# EAGLE design TSAL_v1 (EAGLE 6.5.0)
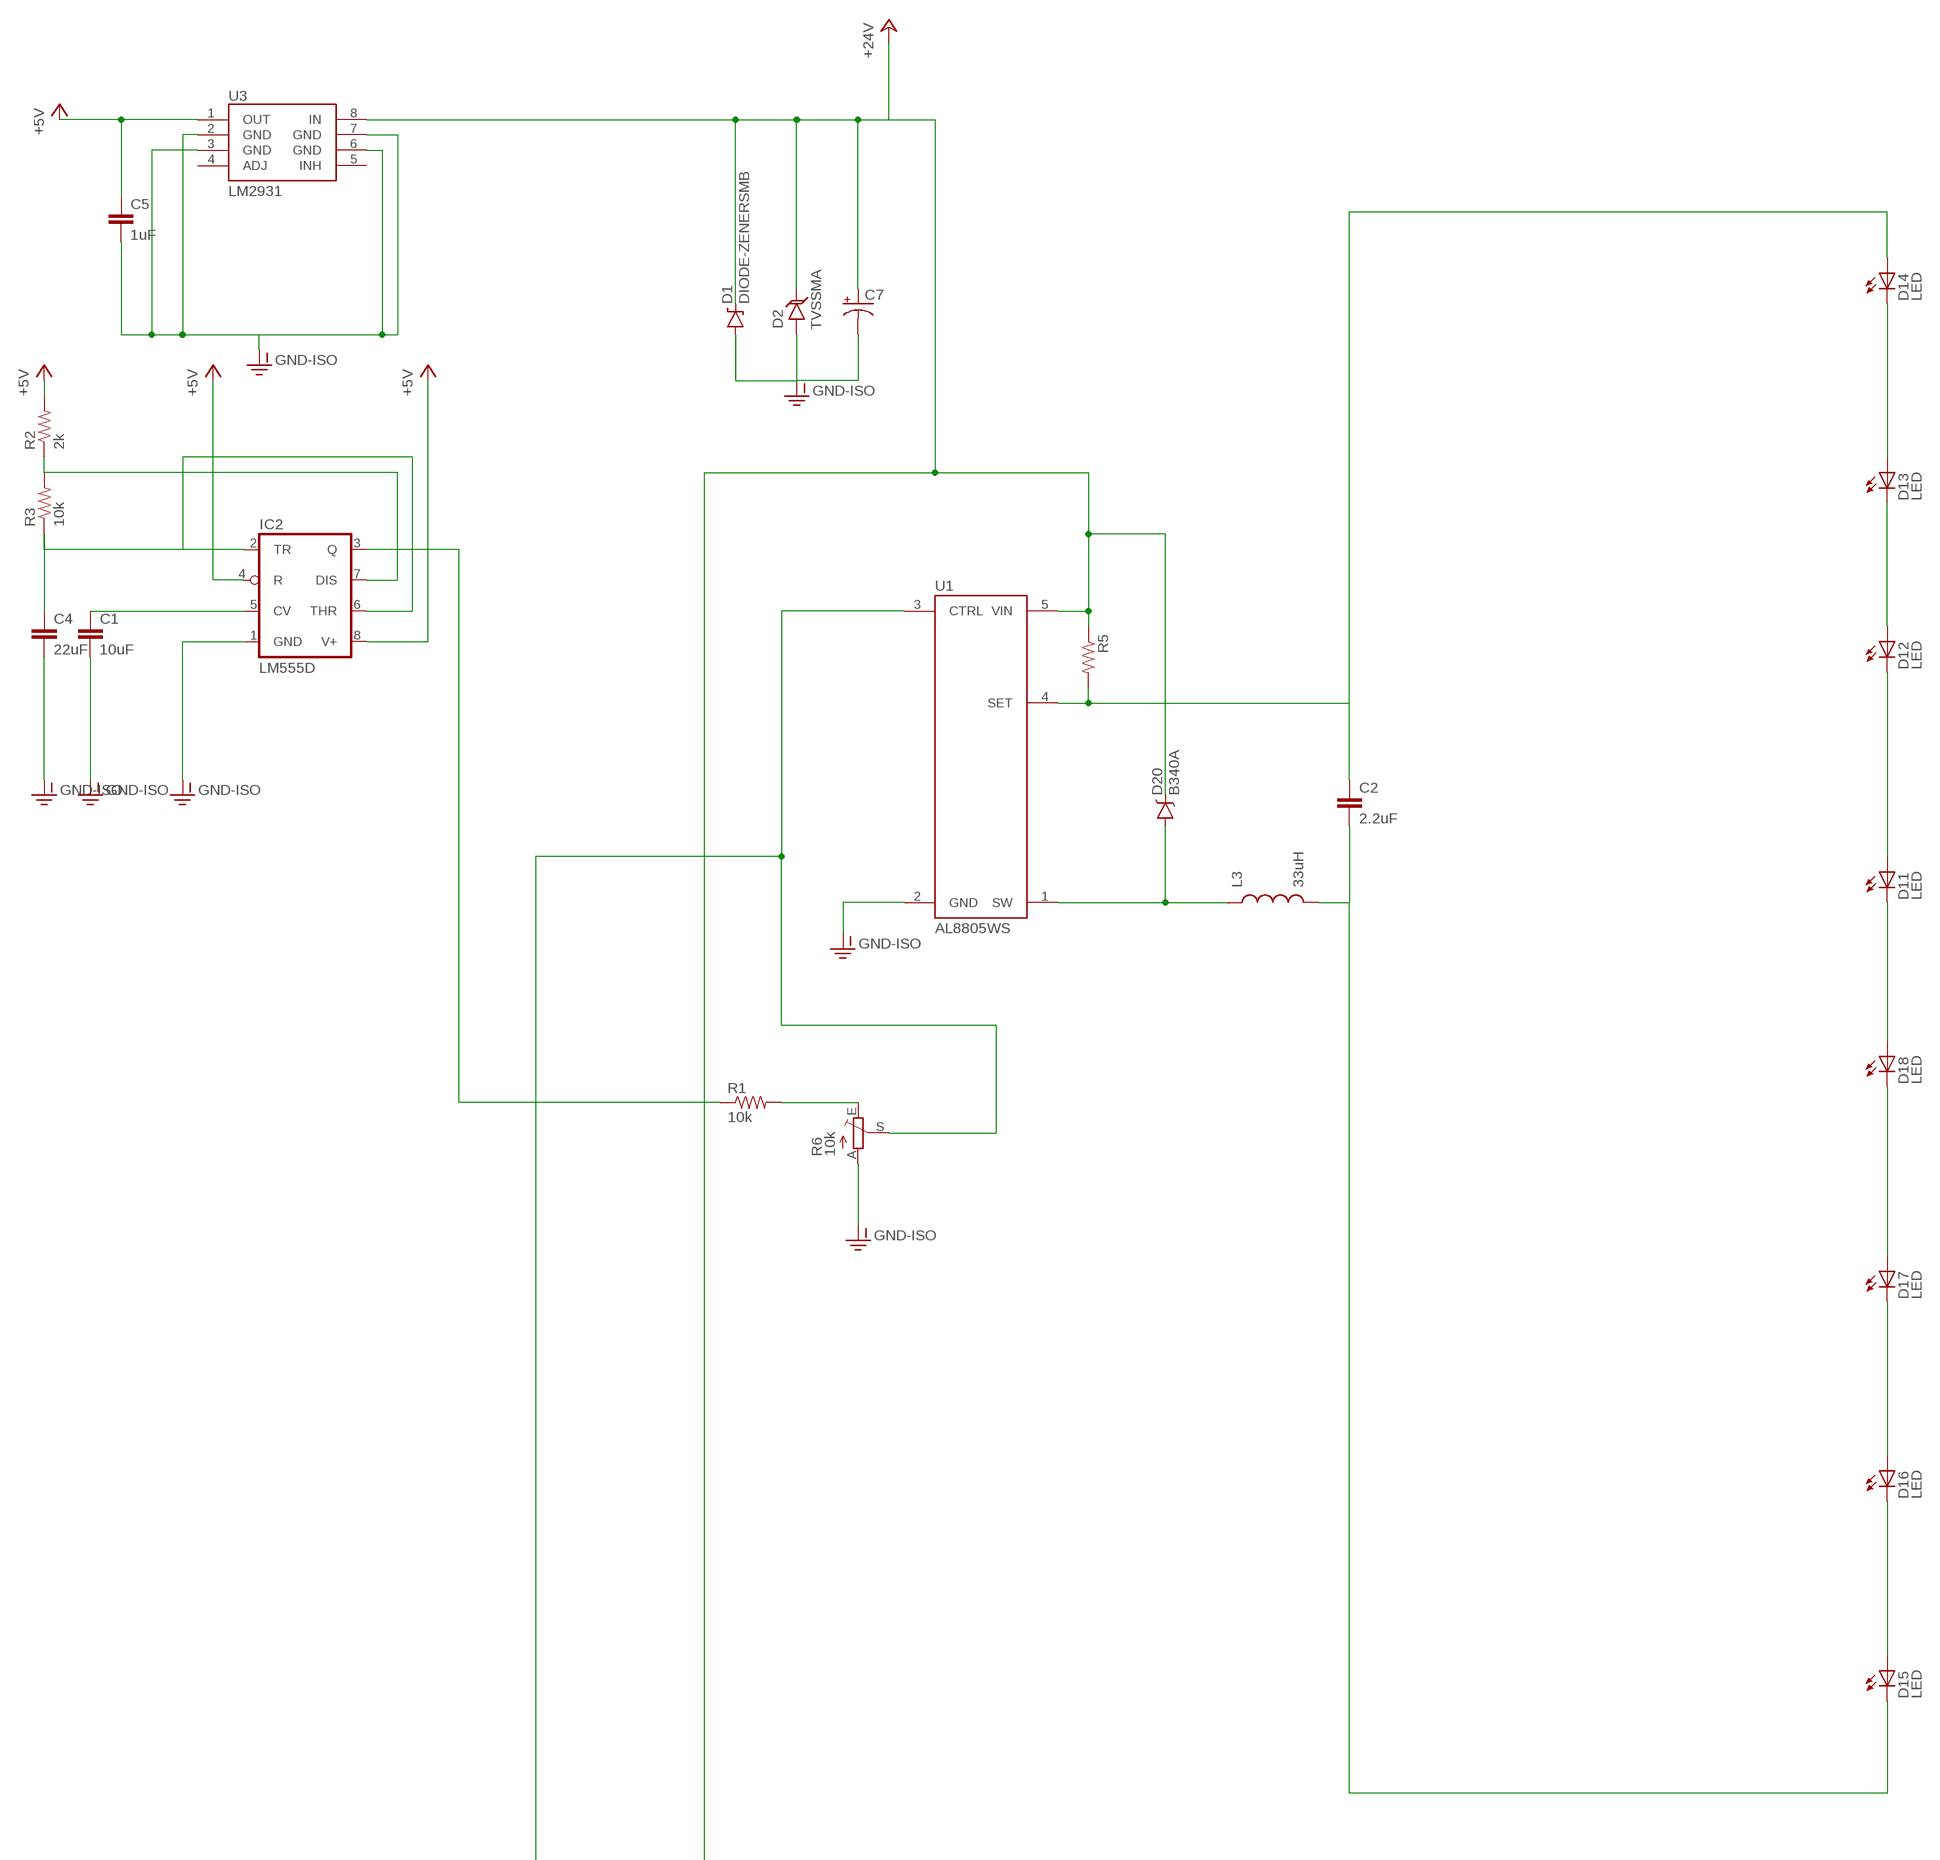
[diagram p0: schematic, sheet 1, part 1 of 2]
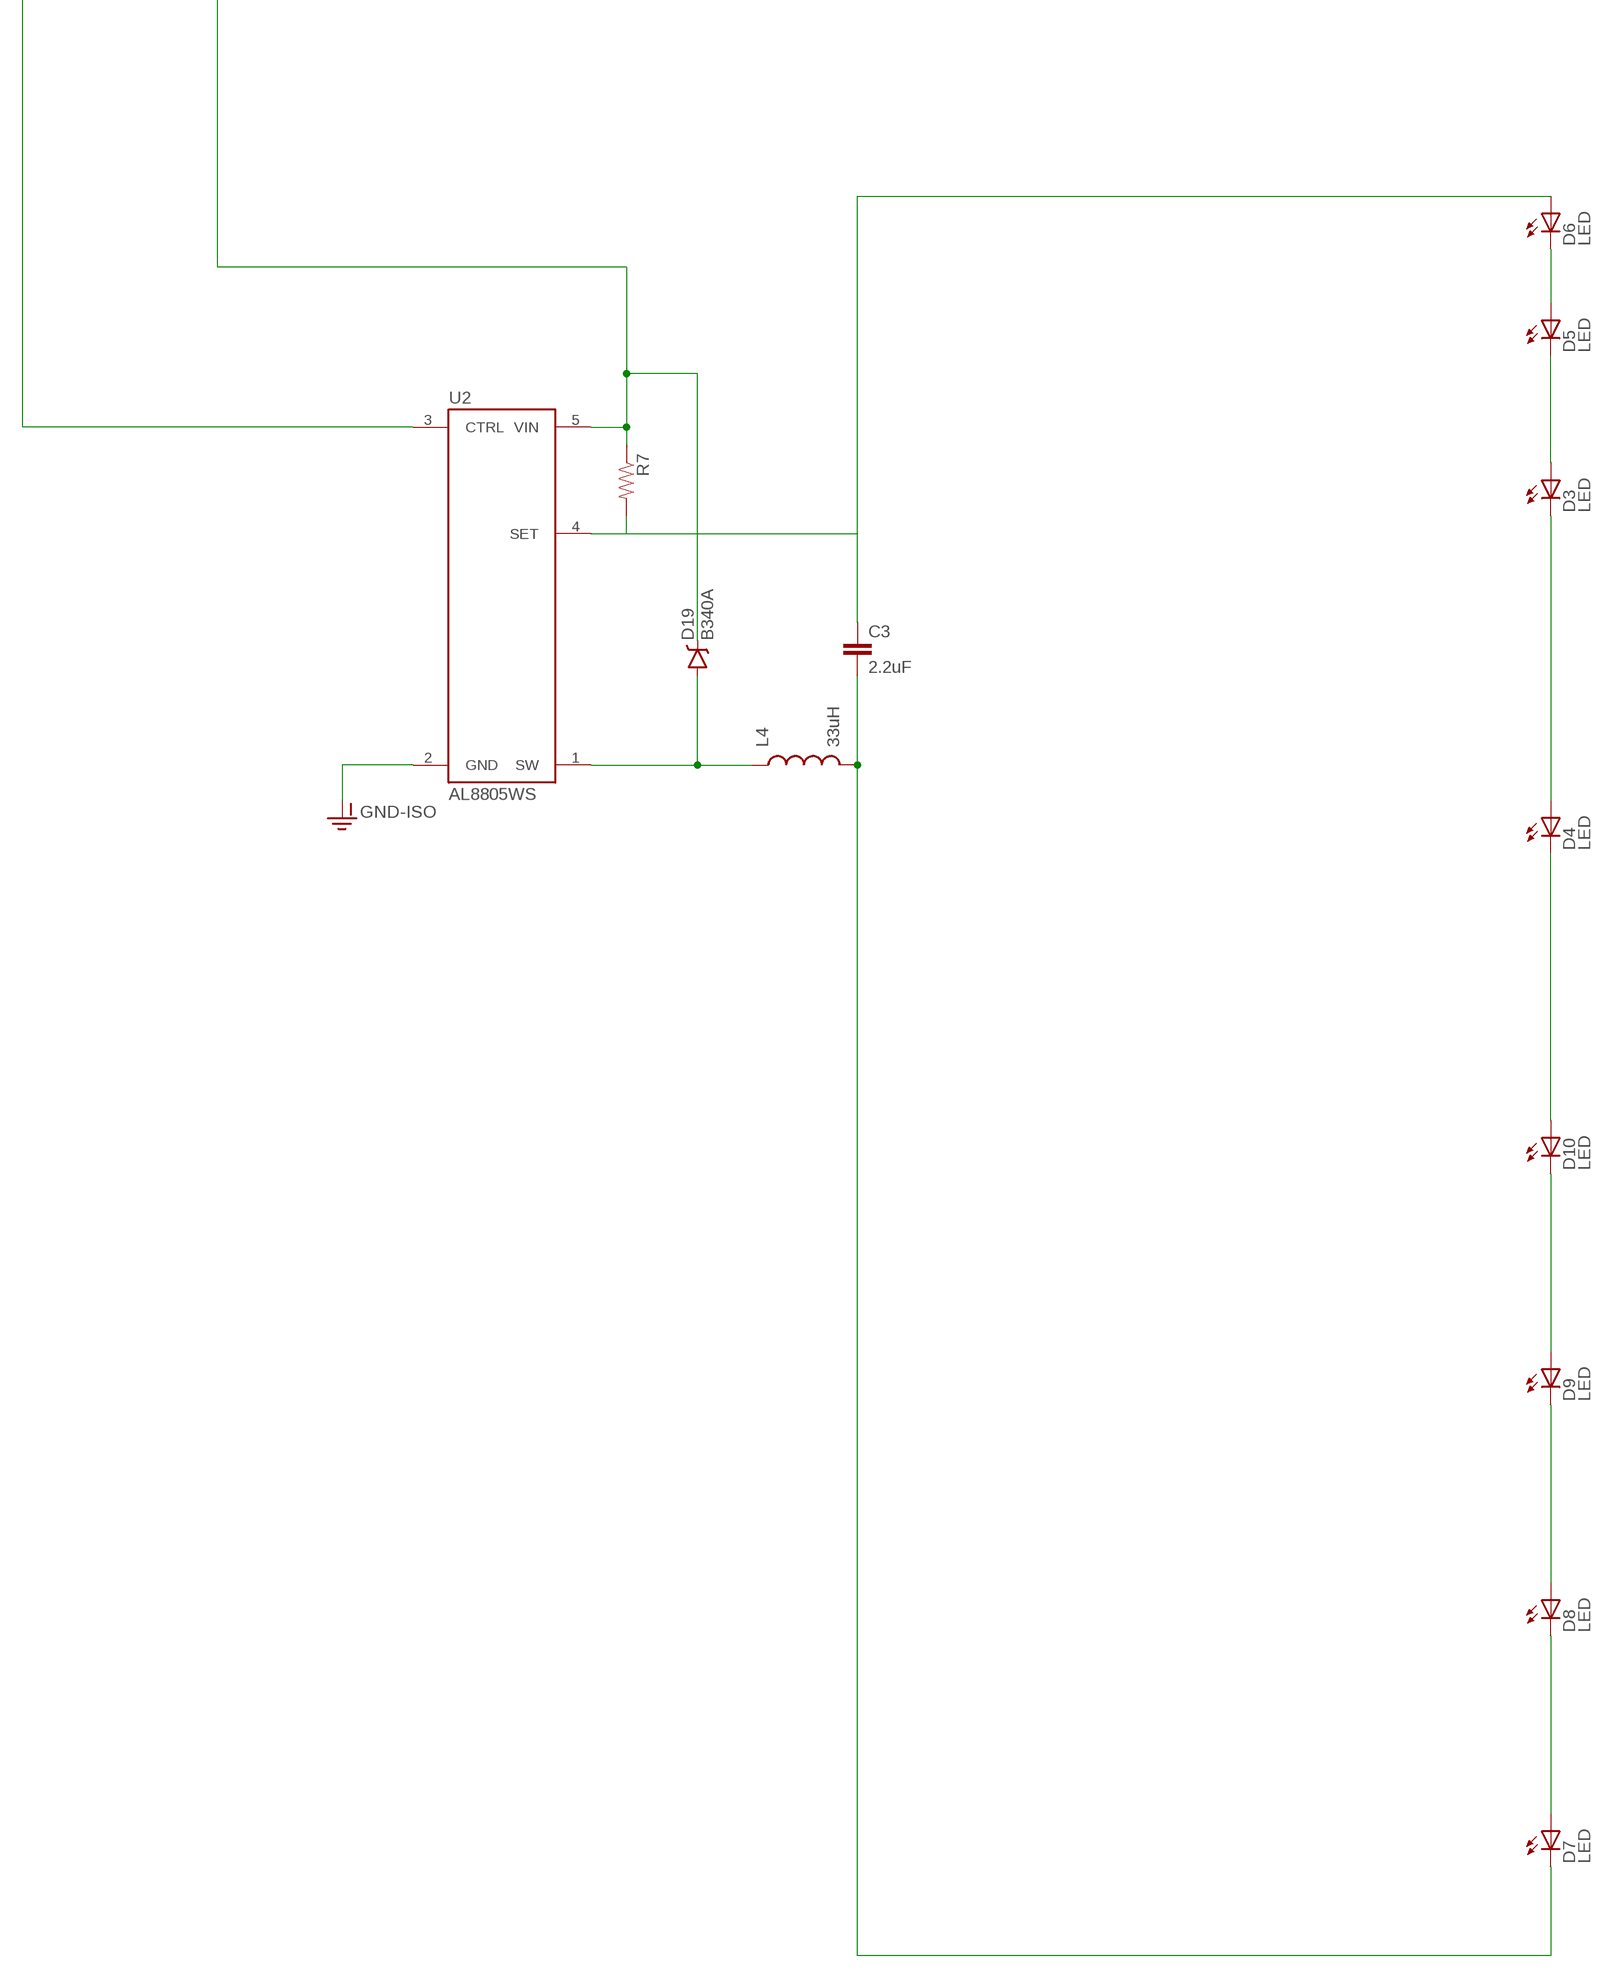
[diagram p1: schematic, sheet 1, part 2 of 2]

## Parts
C1  10uF  CAP0805  [0805]
C2  2.2uF  CAP0805  [0805]
C3  2.2uF  CAP0805  [0805]
C4  22uF  CAP0805  [0805]
C5  1uF  CAP0805  [0805]
C7  CAP_POL6032  [EIA6032]
D1  DIODE-ZENERSMB  [SMB-DIODE]
D2  TVSSMA  [SMA-DIODE]
D3  LED  [LED-SM]
D4  LED  [LED-SM]
D5  LED  [LED-SM]
D6  LED  [LED-SM]
D7  LED  [LED-SM]
D8  LED  [LED-SM]
D9  LED  [LED-SM]
D10  LED  [LED-SM]
D11  LED  [LED-SM]
D12  LED  [LED-SM]
D13  LED  [LED-SM]
D14  LED  [LED-SM]
D15  LED  [LED-SM]
D16  LED  [LED-SM]
D17  LED  [LED-SM]
D18  LED  [LED-SM]
D19  B340A  DIODE-SCHOTTKY-B340A  [SMA-DIODE]
D20  B340A  DIODE-SCHOTTKY-B340A  [SMA-DIODE]
IC2  LM555D  [SO08]
L3  33uH  INDUCTORBOURNS_SRN6045  [SRN6045]
L4  33uH  INDUCTORBOURNS_SRN6045  [SRN6045]
R1  10k  RESISTOR0805-RES  [0805]
R2  2k  RESISTOR0805-RES  [0805]
R3  10k  RESISTOR0805-RES  [0805]
R5  RESISTOR0805-RES  [0805]
R6  10k  TRIM_EU-B25P  [B25P]
R7  RESISTOR0805-RES  [0805]
U1  AL8805WS  AL8805  [SOT23-5]
U2  AL8805WS  AL8805  [SOT23-5]
U3  LM2931  [SO08]

## Nets
+5V: C5.1 IC2.4(R) IC2.8(V+) R2.2 U3.1(OUT)
+24V: C7.P$1(+) D1.C D2.C D19.C D20.C R5.1 R7.1 U1.5(VIN) U2.5(VIN) U3.8(IN)
GND-ISO: C1.2 C4.2 C5.2 C7.P$2(-) D1.A D2.A IC2.1(GND) R6.A U1.2(GND) U2.2(GND) U3.2(GND) U3.3(GND) U3.6(GND) U3.7(GND)
N$1: C3.1 D6.A R7.2 U2.4(SET)
N$2: R6.S U1.3(CTRL) U2.3(CTRL)
N$3: D3.C D4.A
N$4: C1.1 IC2.5(CV)
N$5: IC2.7(DIS) R2.1 R3.2
N$6: IC2.3(Q) R1.1
N$7: D19.A L4.1 U2.1(SW)
N$8: C2.1 D14.A R5.2 U1.4(SET)
N$9: D13.A D14.C
N$10: C4.1 IC2.2(TR) IC2.6(THR) R3.1
N$11: D3.A D5.C
N$12: D12.A D13.C
N$13: D11.A D12.C
N$14: C3.2 D7.C L4.2
N$15: D11.C D18.A
N$16: D17.A D18.C
N$17: D5.A D6.C
N$18: D7.A D8.C
N$19: C2.2 D15.C L3.2
N$20: D8.A D9.C
N$21: D4.C D10.A
N$22: D9.A D10.C
N$23: D16.A D17.C
N$24: D15.A D16.C
N$26: D20.A L3.1 U1.1(SW)
N$27: R1.2 R6.E
Unconnected: U3.4(ADJ) U3.5(INH)

## Library data of the parts
C1-C5 = SparkFun-Capacitors:CAP: Capacitor Standard 0603 ceramic capacitor, and 0.1" leaded capacitor.
C7 = SparkFun-Capacitors:CAP_POL: Capacitor Polarized These are standard SMD and PTH capacitors. Normally 10uF, 47uF, and 100uF in electrolytic and tantalum varieties. Always verify the external diameter of the through hole cap, it varies with capacity, voltage, and manufacturer. The EIA devices should be standard.
D1 = SparkFun-DiscreteSemi:DIODE-ZENER: Zener Diode Production Part - 8199 3.4V Zener Voltage
D2 = SparkFun-DiscreteSemi:TVS: Transient voltage suppressor- prevents ESD on inputs.
D3-D18 = FSAE Eletric:LED
D19 D20 = SparkFun-DiscreteSemi:DIODE-SCHOTTKY: Schottky diodes in SFE's production catalog BAT20J 1A 23V 0.62Vf RB751 120mA 40V 0.37Vf PMEG4005EJ 0.5A 40V 0.42Vf MBRA140 1A 40V 0.5Vf B340A 3A 40V SMA; PROD_ID: DIO-09886
IC2 = adafruit:*555: TIMER Changed DIP package to have round (not oval) pin pads http://www.ladyada.net/library/pcb/eaglelibrary.html
L3 L4 = SparkFun-Passives:INDUCTOR: Inductors Basic Inductor/Choke - 0603 and 1206. Footprints are not proven and vary greatly between part numbers. SRN6045- 33uH, 20% 1.4A SDR0403-560KL - 56uH, 10%, 500mA RMS/740mA peak; PROD_ID: NDUC-11627
R1-R3 R5 R7 = SparkFun-Passives:RESISTOR: Resistor Basic schematic elements and footprints for 0603, 1206, and PTH resistors.
R6 = pot:TRIM_EU-: POTENTIOMETER
U1 U2 = SparkFun-PowerIC:AL8805: Constant current LED driver PWM-able 1MHz switch freq 6V-36V Up to 1A LED current; PROD_ID: IC-11626
U3 = SparkFun-PowerIC:LM2931: LDO regulator with reverse battery protection- very durable!

## Board
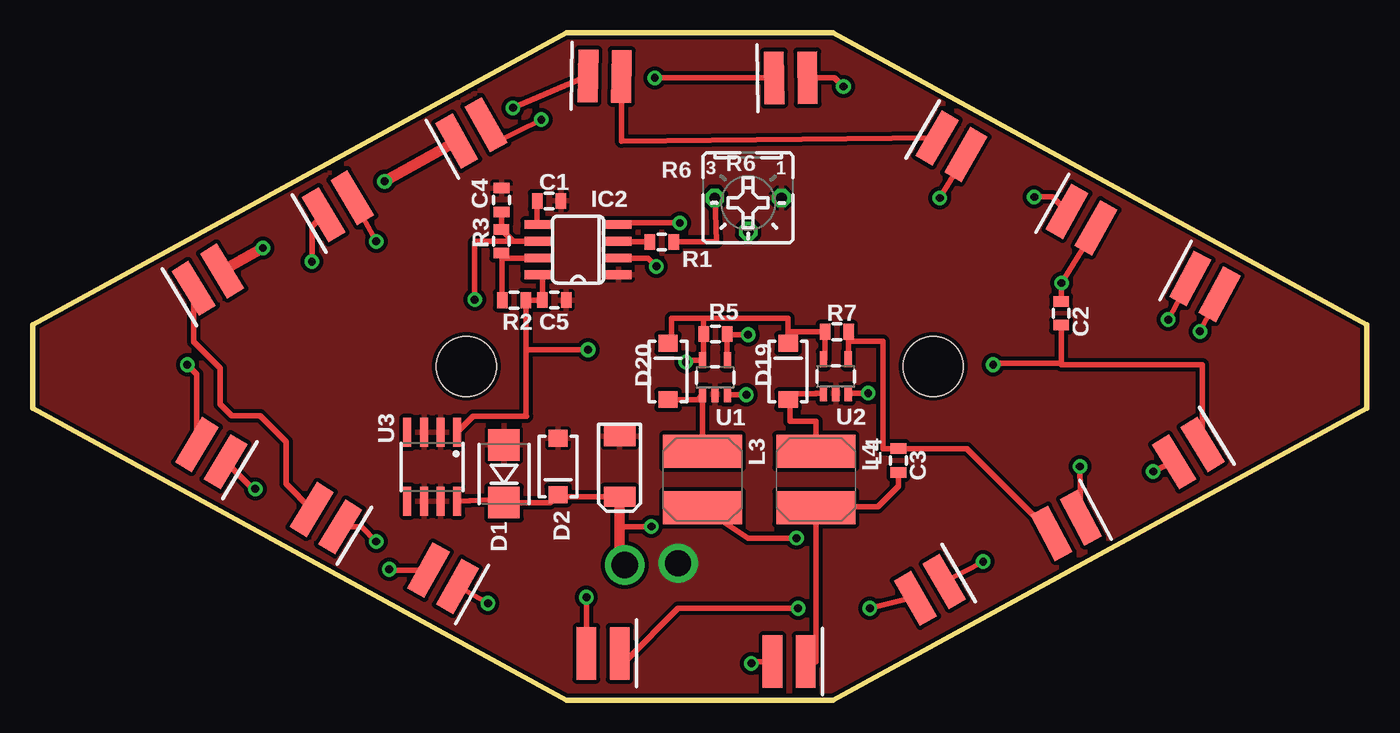
[diagram p2: board, top side]
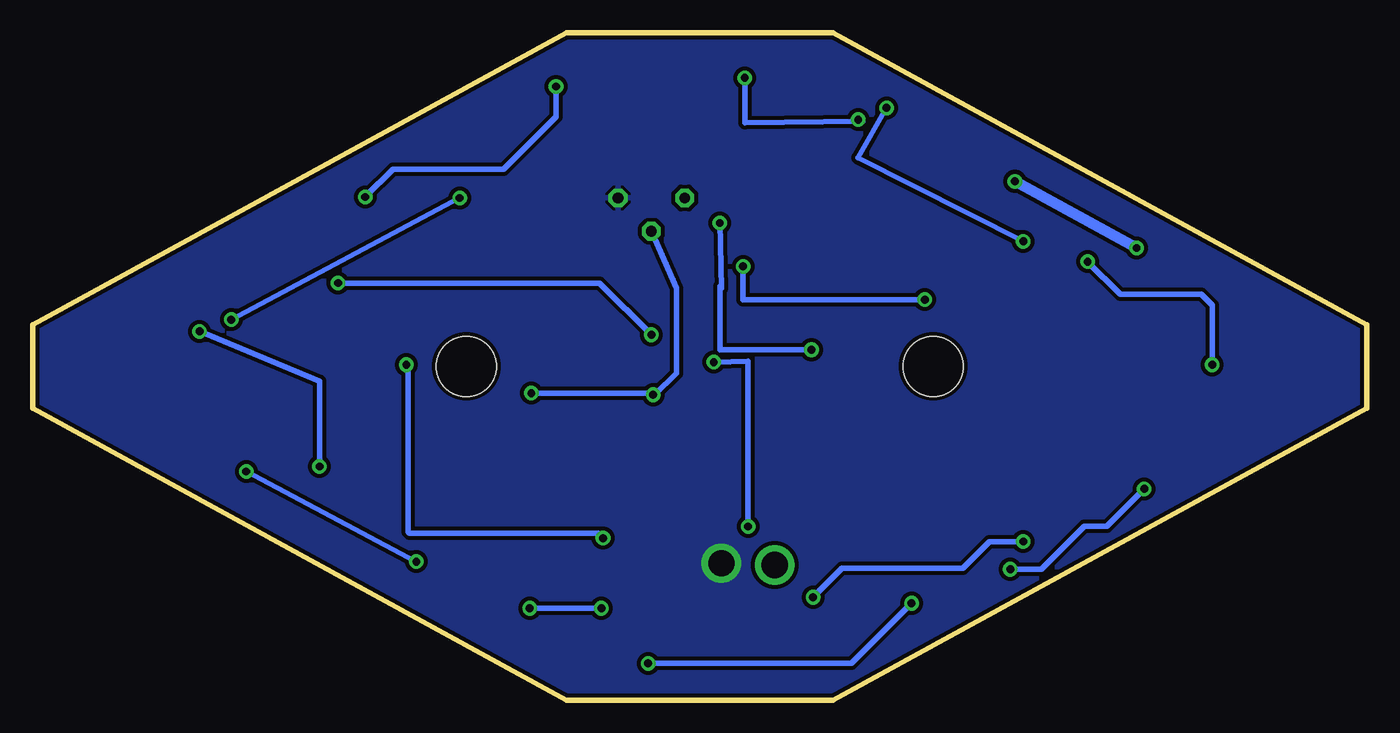
[diagram p3: board, bottom side, seen from below]

Size 101.6 x 50.8 mm. Coordinates in mm from the lower left corner, seen from the top.
Outline: 0,22.22 0,28.57 40.64,50.8 60.96,50.8 101.6,28.57 101.6,22.22 60.96,0 40.64,0 0,22.22
Copper layers (1*16): Top 0.035mm / dielectric 1.5mm / Bottom 0.035mm
Design rules "SparkFun": minimum track width 8mil, minimum drill 20mil, track to track 8mil, track to pad 8mil, pad to pad 8mil, via to via 8mil, smd to smd 8mil, copper to edge 10mil, drill to drill 8mil, minimum pad ring 12mil, minimum via ring 10mil, stop-mask expansion 4mil, vias tented up to drill 25mil, thermal gap 10mil
Holes 4.57 mm at 33.02,25.4 68.58,25.4

### Footprints (pad centres in the part's own frame; a part is rotated, then mirrored left to right if it is on the bottom)
0805 = smd 0.8 x 1.2: 1 -0.9,0; 2 0.9,0
EIA6032 = smd 1.5 x 2.4: P$1 -2.3,0; P$2 2.3,0
SMB-DIODE = smd 2.4 x 2.4: A 2.2,0; C -2.2,0
SMA-DIODE = smd 1.27 x 1.47: A -2.15,0; C 2.15,0
LED-SM = smd 1.5 x 4: A 1.27,0; C -1.27,0
SO08 = smd 0.66 x 2.032: 1 -1.905,-3.073; 2 -0.635,-3.073; 3 0.635,-3.073; 4 1.905,-3.073; 5 1.905,3.073; 6 0.635,3.073; 7 -0.635,3.073; 8 -1.905,3.073
SRN6045 = smd 2.5 x 6: 1 -2.175,-0.175; 2 2.125,-0.175
B25P = drill 0.813 octagon: A -2.54,0; E 2.54,0; S 0,2.54
SOT23-5 = smd 0.55 x 1.2: 1 -0.95,-1.3; 2 0,-1.3; 3 0.95,-1.3; 4 0.95,1.3; 5 -0.95,1.3
SO08' = smd 0.61 x 2.21: 1 -1.905,-2.616; 2 -0.635,-2.616; 3 0.635,-2.616; 4 1.905,-2.616; 5 1.905,2.616; 6 0.635,2.616; 7 -0.635,2.616; 8 -1.905,2.616

### Placement (x,y rotation side)
C1  39.32,38 0 top
C2  78.33,29.44 270 top
C3  65.94,18.24 270 top
C4  35.71,38.07 90 top
C5  39.73,30.45 0 top
C7  44.7,17.78 90 top
D1  35.89,17.22 90 top
D2  40.01,17.78 270 top
D3  69.98,42.16 330 top
D4  43.56,47.5 359.1 top
D5  89.28,31.5 331.7 top
D6  78.71,13.28 207.9 top
D7  57.61,2.92 180.1 top
D8  31.24,9.27 150.7 top
D9  13.59,18.8 149.1 top
D10  23.24,37.59 30.7 top
D11  13.34,32 31.4 top
D12  33.4,43.18 29.4 top
D13  57.73,47.37 0.7 top
D14  79.88,36.58 330.5 top
D15  88.01,18.8 211.4 top
D16  68.33,8.38 210.2 top
D17  43.43,3.56 179.9 top
D18  22.33,13.84 148.7 top
D19  57.53,25.02 90 top
D20  48.39,25.02 90 top
IC2  41.53,34.29 90 top
L3  51.18,16.76 270 top
L4  59.82,16.76 270 top
R1  47.9,34.87 0 top
R2  36.65,30.43 0 top
R3  35.69,34.92 270 top
R5  51.99,27.86 0 top
R6  54.48,38.23 180 top
R7  61.24,28.04 0 top
U1  51.97,24.56 0 top
U2  61.16,24.64 0 top
U3  LM2931  [SO08']  30.43,17.75 180 top

### Tracks (layer width: path | path; a pad name or v marks a point on that pad's centre or on a via)
+5V  (via drill 0.6)
  Top 0.406: U3.1 33.55,21.59 37.59,21.59 37.55,21.63 37.55,26.92 | 37.55,26.92 R2.2 37.58,30.45 C5.1 38.83,32.38 IC2.8 | IC2.4 44.73,36.32 v49.28,36.32 | v42.29,26.67 37.81,26.67 arc-90 37.55,26.92
  Bottom 0.406: v49.28,36.32 49.15,31.37 49.28,31.37 | 49.28,31.37 49.28,31.5 | 49.28,31.37 49.28,26.67 v42.29,26.67
+24V  (via drill 0.6 pad 0.25, 2)
  Top 0.406: 51.09,29.08 48.64,29.08 48.64,27.17 D20.C | 51.09,29.08 R5.1 51.09,25.86 U1.5 50.25,25.86 v49.73,25.73 | 51.09,29.08 57.53,29.08 57.53,28.04 | D19.C 57.53,28.04 | 57.53,28.04 R7.1 60.34,25.94 U2.5 | U3.8 33.25,15.17 36.74,15.3 36.74,15.02 | v47.12,13.21 44.7,13.21 C7.P$1 40.16,15.48 D2.C 39.4,15.02 36.74,15.02 | D1.C 36.74,15.02
  Top 0.813: v45.09,10.29 44.7,10.67 C7.P$1
  Bottom 0.406: v49.73,25.73 47.12,25.78 v47.12,13.21
GND-ISO  (via drill 2)
  other vias: 49.15,10.41
  pour Top (isolate 0.305): 40.51,50.55 60.83,50.55 101.47,28.7 101.47,22.1 60.83,0.25 41.02,0.25 0.38,22.61 0.38,28.7
  pour Bottom (isolate 0.305): 40.51,51.05 60.83,51.05 101.47,28.7 101.47,22.1 60.83,-0.25 40.51,-0.25 -0.13,22.1 -0.13,28.7
N$1
  Top 0.406: U2.4 62.13,27.06 | 62.13,27.06 R7.2 | 62.13,27.06 62.13,27.3 64.77,27.3 64.77,19.14 C3.1 71.14,19.14 D6.A
N$2  (via drill 0.6)
  Top 0.406: U2.3 63.63,23.34 v63.63,23.37 | v54.36,23.24 53.09,23.24 | 53.09,23.24 52.92,23.24 U1.3 52.92,23.34 52.99,23.34 53.09,23.24
  Bottom 0.406: v63.63,23.37 54.36,23.37 v54.36,23.24 54.23,23.24 52.58,24.89 52.58,31.37 R6.S
N$3
  Top 0.406: D3.C 44.83,42.55 D4.A
N$4
  Top 0.406: IC2.5 38.42,36.23 C1.1
N$5
  Top 0.406: 35.69,30.49 R2.1 35.75,33.27 35.75,33.66 | 35.75,33.66 IC2.7 | R3.2 35.75,34.02 35.75,33.66
N$6
  Top 0.406: IC2.3 44.65,34.87 R1.1
N$7
  Top 0.406: U2.1 59.64,23.34 59.64,23.32 57.73,23.32 57.73,22.87 57.66,22.87 | L4.1 59.64,21.21 57.66,21.21 57.66,22.87 | D19.A 57.66,22.87
N$8  (via drill 0.6 pad 0.25)
  Top 0.406: U1.4 52.89,25.89 R5.2 52.95,27.81 v54.48,27.81 | C2.1 v78.36,31.75 D14.A
  Bottom 0.406: v54.48,27.81 58.42,31.75 v78.36,31.75
N$9  (via drill 0.6)
  Top 0.406: D13.A 61.07,47.39 v61.75,46.71 | v76.28,38.3 77.68,38.3 D14.C
  Bottom 0.406: v61.75,46.71 61.75,44.42 65.76,40.41 74.17,40.41 v76.28,38.3
N$10  (via drill 0.6)
  Top 0.406: C4.1 35.71,35.82 R3.1 36.59,34.92 IC2.6 33.78,34.92 33.78,34.8 33.66,34.8 v33.66,30.48 | v47.5,33.02 46.86,33.66 IC2.2
  Bottom 0.406: v47.5,33.02 47.5,30.48 v33.66,30.48
N$11  (via drill 0.6 pad 0.25)
  Top 0.406: D5.C v86.49,28.96 | v69.09,38.23 D3.A
  Bottom 0.406: v86.49,28.96 v69.09,38.23
N$12  (via drill 0.6 pad 0.25)
  Top 0.406: D13.C 56.45,47.37 v47.37,47.37 | v38.73,44.2 35.18,42.42 D12.A
  Bottom 0.406: v47.37,47.37 47.37,43.94 38.35,44.07 v38.73,44.2
N$13  (via drill 0.6)
  Top 0.813: D12.C v26.8,39.5 | v17.53,34.42 D11.A
  Bottom 0.813: v26.8,39.5 v17.53,34.42
N$14
  Top 0.406: D7.C 59.64,2.92 L4.2 60.69,14.73 64.39,14.73 65.94,16.28 C3.2
N$15
  Top 0.406: D11.C 12.25,27.3 14.28,25.27 14.28,22.53 15.16,21.64 17.3,21.64 19.28,19.66 19.28,16.47 D18.A
N$16  (via drill 0.6)
  Top 0.406: D18.C 25.04,13.18 v26.16,12.07 | v42.16,7.82 D17.A
  Bottom 0.406: v26.16,12.07 28.73,12.07 30.76,10.03 39.95,10.03 v42.16,7.82
N$17  (via drill 0.6 pad 0.25)
  Top 0.406: D6.C v79.76,17.78 | v88.9,28.07 D5.A
  Bottom 0.406: v79.76,17.78 79.76,24.26 v88.9,28.07
N$18  (via drill 0.6)
  Top 0.406: D8.C v34.67,7.37 | v54.74,2.79 54.86,2.92 D7.A
  Bottom 0.406: v34.67,7.37 39.24,2.79 v54.74,2.79
N$19  (via drill 0.6)
  Top 0.406: D15.C 89.09,25.53 78.36,25.53 78.36,25.65 | 78.36,25.65 78.36,28.54 C2.2 | L3.2 54.47,12.32 v58.17,12.32 | v73.15,25.53 73.28,25.65 78.36,25.65
  Bottom 0.406: v58.17,12.32 58.55,12.7 72.9,12.7 73.02,12.83 73.02,25.65 v73.15,25.53
N$20  (via drill 0.6)
  Top 0.406: D8.A 27.22,9.89 v27.15,9.96 | v16.94,16.08 16.74,16.08 D9.C
  Bottom 0.406: v27.15,9.96 24.76,9.96 21.49,13.23 19.79,13.23 v16.94,16.08
N$21  (via drill 0.6 pad 0.25)
  Top 0.406: D4.C v36.58,45.09 | v26.16,34.92 D10.A
  Bottom 0.406: v36.58,45.09 38.73,41.27 v26.16,34.92
N$22  (via drill 0.6)
  Top 0.406: D9.A 12.5,24.79 v11.76,25.53 | v21.26,33.38 21.26,36.05 D10.C
  Bottom 0.406: v11.76,25.53 11.76,30.05 12.6,30.89 18.77,30.89 v21.26,33.38
N$23  (via drill 0.6)
  Top 0.406: D17.C 45.22,3.04 49.16,6.98 v58.29,6.98 | v63.75,6.98 66.8,7.74 D16.A
  Bottom 0.406: v58.29,6.98 v63.75,6.98
N$24  (via drill 0.6)
  Top 0.406: D16.C v72.39,10.54 | v85.34,17.4 D15.A
  Bottom 0.406: v72.39,10.54 v85.34,17.4
N$26
  Top 0.406: D20.A 50.63,22.87 U1.1 51.02,20.47 L3.1
N$27
  Top 0.406: R1.2 52.07,34.87 R6.E

### Text on the board
_tsilk: R6 | 3 | 1 | C1 | IC2 | C4 | R3 | R1 | C2 | R5 | R7 | R2 | C5 | D20 | D19 | U3 | U1 | U2 | L3 | L4 | C3 | D2 | D1